# Altium schematic sheet HEATER.SchDoc
size 420 x 297 mm; SheetNumber: 6; SheetTotal: 11
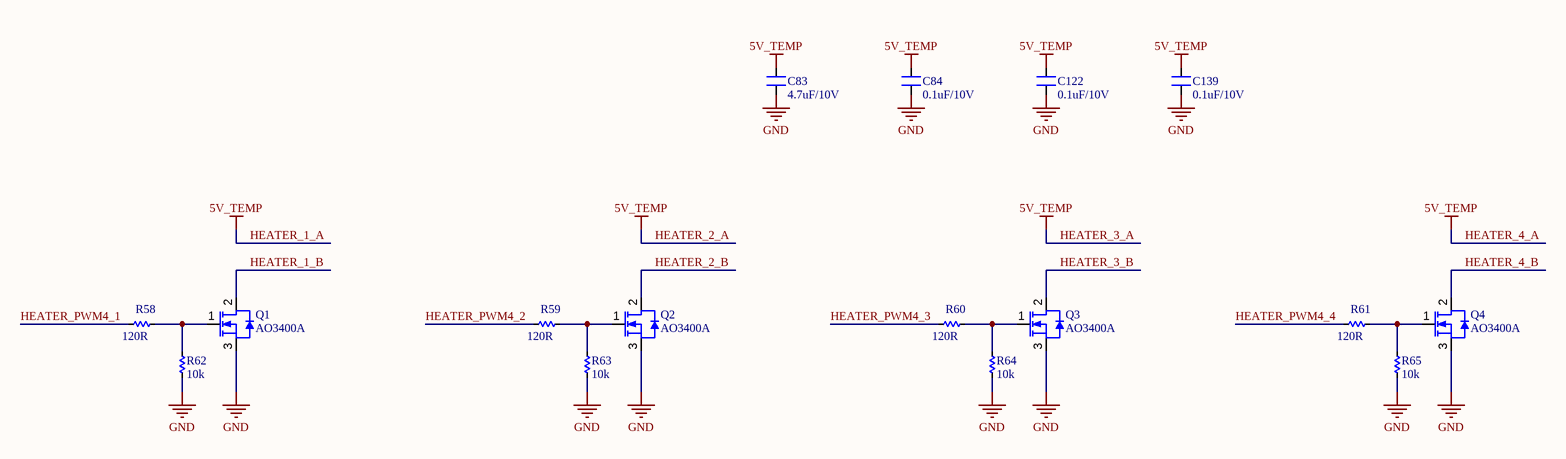
[diagram p0: HEATER.SchDoc]

## Parts
C83  4.7uF/10V  [CAP_C_1608X80]
C84  0.1uF/10V  [CAP_C_1608X80]
C122  0.1uF/10V  [CAP_C_1608X80]
C139  0.1uF/10V  [CAP_C_1608X80]
Q1  AO3400A  [SOT23-13_2]
Q2  AO3400A  [SOT23-13_2]
Q3  AO3400A  [SOT23-13_2]
Q4  AO3400A  [SOT23-13_2]
R58  120R  [RES_C_1608X60]
R59  120R  [RES_C_1608X60]
R60  120R  [RES_C_1608X60]
R61  120R  [RES_C_1608X60]
R62  10k  [RES_C_1608X60]
R63  10k  [RES_C_1608X60]
R64  10k  [RES_C_1608X60]
R65  10k  [RES_C_1608X60]

## Nets
GND: C83.1 C84.1 C122.1 C139.1 Q1.3(S) Q2.3(S) Q3.3(S) Q4.3(S) R62.1 R63.1 R64.1 R65.1
HEATER_1_A: C83.2 C84.2 C122.2 C139.2  [also labelled 5V_TEMP, HEATER_2_A, HEATER_3_A, HEATER_4_A]
HEATER_1_B: Q1.2(D)
HEATER_2_B: Q2.2(D)
HEATER_3_B: Q3.2(D)
HEATER_4_B: Q4.2(D)
HEATER_PWM4_1: R58.1
HEATER_PWM4_2: R59.1
HEATER_PWM4_3: R60.1
HEATER_PWM4_4: R61.1
NetQ1_1: Q1.1(G) R58.2 R62.2
NetQ2_1: Q2.1(G) R59.2 R63.2
NetQ3_1: Q3.1(G) R60.2 R64.2
NetQ4_1: Q4.1(G) R61.2 R65.2

## Notes on the sheet
- Project:
- BEE-PC1
- Sub-system:
- NANORACK_EXP_CONTROLLER
- Design by:
- SANG HUYNH
- BAO BUI Q.
- Sheet title:
- Sheet
- A3
- of
- Checked by:
- Approved by:
- VU PHAM
- Revision:
- Document No:
- V1.1.1
- Size:
- Date:

## Library data of the parts
C83 C84 C122 C139 = Capacitors: Value: 33pF
Q1-Q4 = AO3400A: MOSFET N-CH 30V 5.7A SOT23-3L
R58-R65 = Res SMD: SMD; Manufacturer: Generic Components; Class: Passive; Published: 08/06/2000; Publisher: Altium Hobart Technology Centre